# EAGLE design open-access-interlock-v1-1-relay-5mm (EAGLE 5.11)
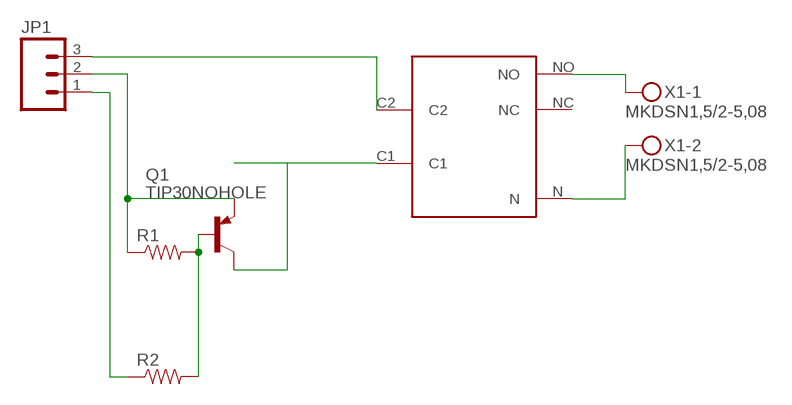
[diagram p0: schematic, sheet 1]

## Parts
JP1  M03LONGPADS  [1X03_LONGPADS]
Q1  TIP30NOHOLE  [TO220-NOHOLE]
R1  RESISTORAXIAL-0.3  [AXIAL-0.3]
R2  RESISTORAXIAL-0.3  [AXIAL-0.3]
U$1  OUDH-SH-105D  [A]
X1  MKDSN1,5/2-5,08  [MKDSN1,5/2-5,08]

## Nets
N$1: U$1.N X1.2
N$2: U$1.NO X1.1
N$3: Q1.2(C) U$1.C1
N$4: JP1.1 R2.P$1
N$5: Q1.1(B) R1.P$2 R2.P$2
N$6: JP1.2 Q1.3(E) R1.P$1
N$7: JP1.3 U$1.C2
Unconnected: U$1.NC

## Library data of the parts
JP1 = SparkFun:M03: Header 3 Standard 3-pin 0.1" header. Use with straight break away headers (SKU : PRT-00116), right angle break away headers (PRT-00553), swiss pins (PRT-00743), machine pins (PRT-00117), and female headers (PRT-00115). Molex polarized connector foot print use with SKU : PRT-08232 with associated crimp pins and housings.
Q1 = adafruit:TIP30: PNP Transistor
R1 R2 = SparkFun:RESISTOR: Resistor Basic schematic elements and footprints for 0603, 1206, and PTH resistors.
U$1 = will-oudh-sh-105d:OUDH-SH-105D: Relay
X1 = con-phoenix-508:MKDSN1,5/2-5,08: MKDSN 1,5/ 2-5,08 Printklemme Nennstrom: 13,5 A Nennspannung: 250 V Rastermaß: 5,08 mm Polzahl: 2 Anschlussart: Schraubanschluss Montage: Löten Anschlussrichtung Leiter/Platine: 0 ° Artikelnummer: 1729128 Source: http://eshop.phoenixcontact.com .. 1729128.pdf; MPN: MKDSN 1,5/2-5.08; OC_FARNELL: 1792903; OC_NEWARK: 30M2397

## Board
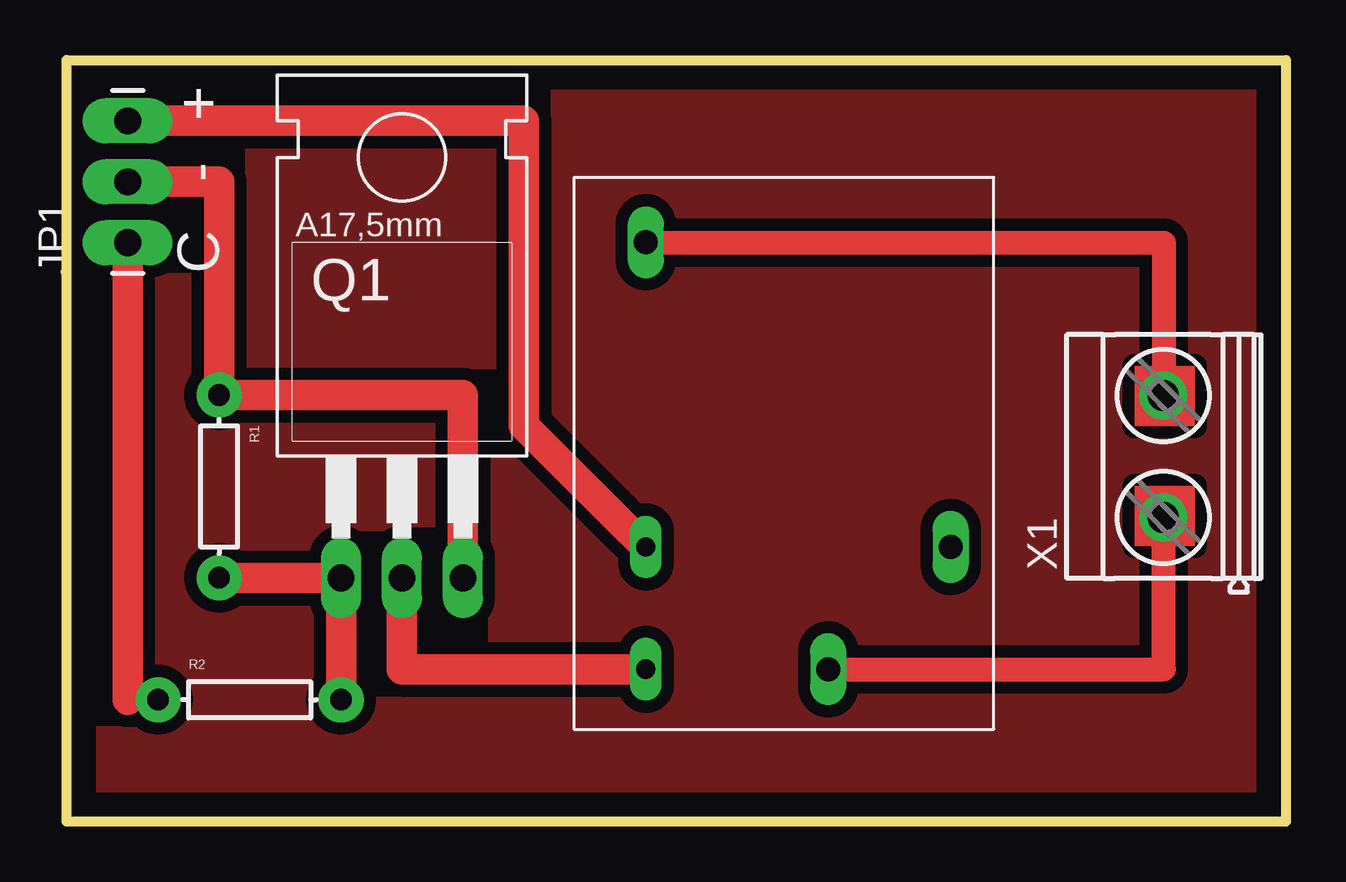
[diagram p1: board, top side]

Size 50.8 x 31.75 mm. Coordinates in mm from the lower left corner, seen from the top.
Outline: 0,0 0,31.75 50.8,31.75 50.8,0 0,0
Copper layers (1*16): Top 0.035mm / dielectric 1.5mm / Bottom 0.035mm
Design rules "default *": minimum track width 10mil, minimum drill 24mil, track to track 20mil, track to pad 50mil, pad to pad 50mil, via to via 20mil, smd to smd 8mil, copper to edge 40mil, drill to drill 8mil, minimum pad ring 10mil, minimum via ring 8mil, stop-mask expansion 4mil, vias tented up to drill 0mil, thermal gap 10mil

### Footprints (pad centres in the part's own frame; a part is rotated, then mirrored left to right if it is on the bottom)
1X03_LONGPADS = drill 1.118 pad 1.88 long: 1 0,0; 2 2.54,0; 3 5.08,0
TO220-NOHOLE = drill 1.118 long: 1 -2.54,-6.35; 2 0,-6.35; 3 2.54,-6.35
AXIAL-0.3 = drill 0.9 pad 1.88 round: P$1 -3.81,0; P$2 3.81,0
A = drill 0.8 long: C1 0,0; C2 5.1,0 | drill 1 long: N 17.8,0; NC 5.1,-12.7; NO 0,-7.6
MKDSN1,5/2-5,08 = drill 1.3 pad 2 round: 1 -2.561,0.025; 2 2.519,0.025

### Placement (x,y rotation side)
JP1  2.54,24.13 90 top
Q1  13.97,16.51 0 top
R1  6.35,13.97 270 top
R2  7.62,5.08 0 top
U$1  24.13,6.35 90 top
X1  45.72,15.24 90 top

### Tracks (layer width: path | path; a pad name or v marks a point on that pad's centre or on a via)
N$1
  Top 0.254: U$1.N 24.13,24.13 | 45.72,17.78 X1.2
  Top 1: 24.13,24.13 45.72,24.13 45.72,17.78
N$2
  Top 0.254: 45.72,12.7 X1.1
  Top 1: 45.72,12.7 45.72,6.35 U$1.NO
N$3
  Top 1.27: U$1.C1 13.97,6.35 Q1.2
N$4
  Top 0.254: R2.P$1 2.54,5.08
  Top 1.27: 2.54,5.08 JP1.1
N$5
  Top 1.27: R1.P$2 Q1.1 R2.P$2
N$6
  Top 1.27: JP1.2 6.35,26.67 R1.P$1 16.51,17.78 Q1.3
N$7
  Top 1.27: JP1.3 19.05,29.21 19.05,16.51 22.86,12.7 U$1.C2
N$8
  pour Top: 0,0 0,31.5 50.5,32 50.5,0
(copper drawn outside any net)
  shapes: Top area x2

### Text on the board
tNames: + | - | C